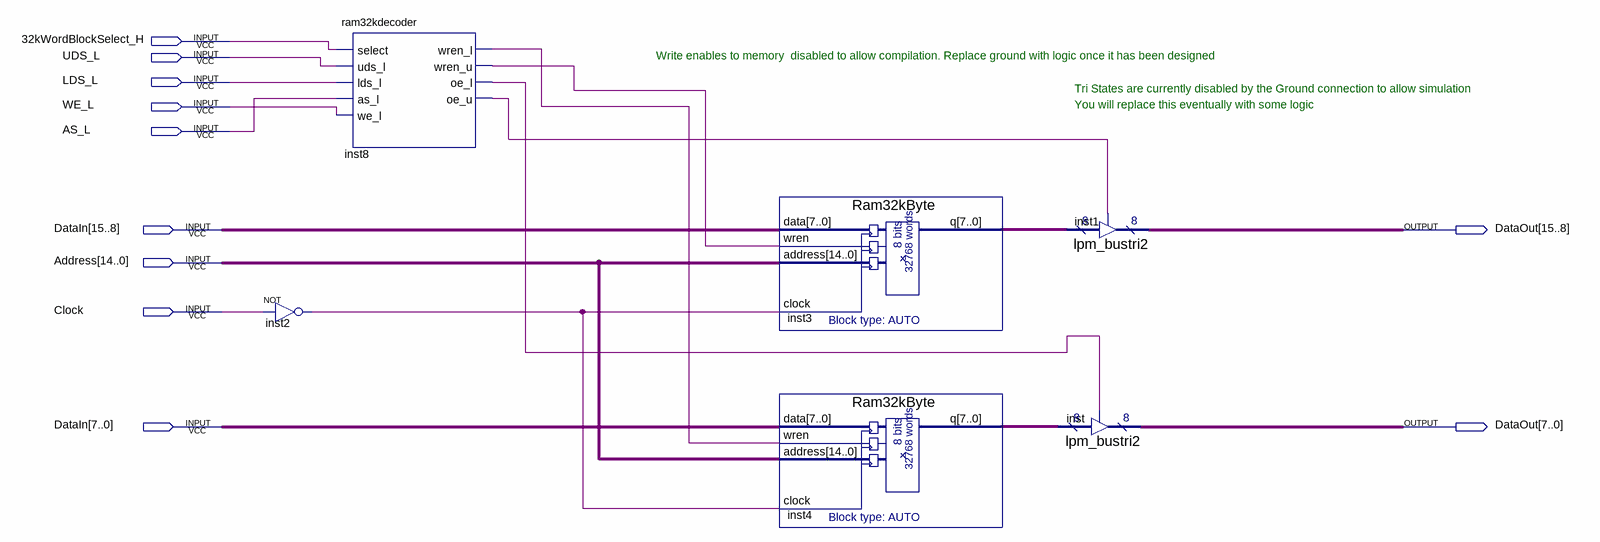
[diagram p0: schematic sheet]
// Quartus schematic SramBlock_32KWord.bdf as structural Verilog: 6 symbols, 11 pins
module SramBlock_32KWord (
  input  \32kWordBlockSelect_H ,
  input  UDS_L,
  input  LDS_L,
  input  WE_L,
  input  AS_L,
  input  [15:0] DataIn,
  input  [14:0] Address,
  input  Clock,
  output [15:0] DataOut
);

  wire inst2_out, inst8_oe_l, inst8_oe_u, inst8_wren_l, inst8_wren_u;
  wire [7:0] inst3_q, inst4_q;

  not inst2 (inst2_out, Clock);
  ram32kdecoder inst8 (
    .select(\32kWordBlockSelect_H ), .uds_l(UDS_L), .lds_l(LDS_L), .as_l(AS_L), .we_l(WE_L),
    .wren_l(inst8_wren_l), .wren_u(inst8_wren_u), .oe_l(inst8_oe_l), .oe_u(inst8_oe_u));
  Ram32kByte inst3 (.data(DataIn[15:8]), .wren(inst8_wren_u), .address(Address), .clock(inst2_out), .q(inst3_q));
  Ram32kByte inst4 (.data(DataIn[7:0]), .wren(inst8_wren_l), .address(Address), .clock(inst2_out), .q(inst4_q));
  lpm_bustri2 inst1 (.enabledt(inst8_oe_u), .data(inst3_q), .tridata(DataOut[15:8]));
  lpm_bustri2 inst (.enabledt(inst8_oe_l), .data(inst4_q), .tridata(DataOut[7:0]));

  // Notes on the sheet:
  //   Write enables to memory  disabled to allow compilation. Replace ground with logic once it has been designed
  //   Tri States are currently disabled by the Ground connection to allow simulation
  //   You will replace this eventually with some logic
endmodule
